# Altium schematic sheet SparkIO Thermal Shield.SchDoc: SparkIO Thermal Shield - Aux ADC
size A4; DrawnBy: Jim Griszbacher; Revision: A; SheetNumber: 1; SheetTotal: 1; ProjectName: SparkIO Thermal Shield
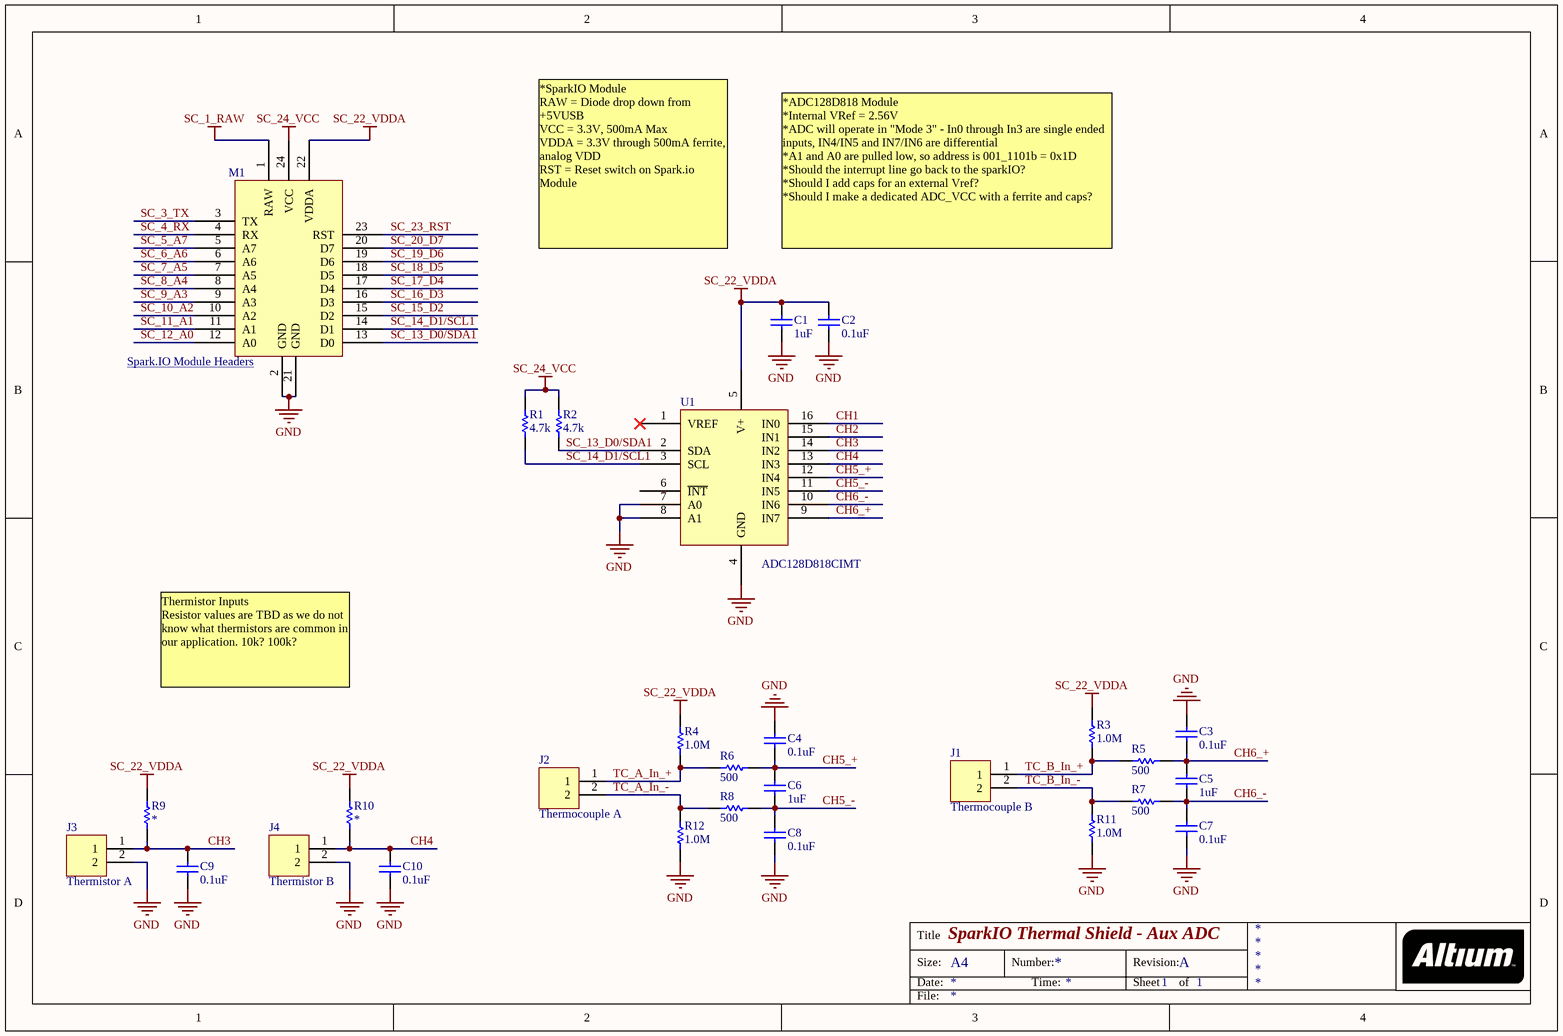
[diagram p0: SparkIO Thermal Shield.SchDoc]

## Parts
C1  value 1uF  [0603]  (hidden comment: Capacitor)
C2  value 0.1uF  [0603]  (hidden comment: Capacitor)
C3  value 0.1uF  [0603]  (hidden comment: Capacitor)
C4  value 0.1uF  [0603]  (hidden comment: Capacitor)
C5  value 1uF  [0603]  (hidden comment: Capacitor)
C6  value 1uF  [0603]  (hidden comment: Capacitor)
C7  value 0.1uF  [0603]  (hidden comment: Capacitor)
C8  value 0.1uF  [0603]  (hidden comment: Capacitor)
C9  value 0.1uF  [0603]  (hidden comment: Capacitor)
C10  value 0.1uF  [0603]  (hidden comment: Capacitor)
J1  Thermocouple B  [HDR1X2]
J2  Thermocouple A  [HDR1X2]
J3  Thermistor A  [HDR1X2]
J4  Thermistor B  [HDR1X2]
M1  Spark.IO Module Headers
R1  value 4.7k  [0603]  (hidden comment: Resistor)
R2  value 4.7k  [0603]  (hidden comment: Resistor)
R3  value 1.0M  [0603]  (hidden comment: Resistor)
R4  value 1.0M  [0603]  (hidden comment: Resistor)
R5  value 500  [0603]  (hidden comment: Resistor)
R6  value 500  [0603]  (hidden comment: Resistor)
R7  value 500  [0603]  (hidden comment: Resistor)
R8  value 500  [0603]  (hidden comment: Resistor)
R9  Resistor  [0603]  (value not drawn)
R10  Resistor  [0603]  (value not drawn)
R11  value 1.0M  [0603]  (hidden comment: Resistor)
R12  value 1.0M  [0603]  (hidden comment: Resistor)
U1  ADC128D818CIMT  [TSSOP16]

## Nets
GND: C1.2 C2.2 C3.1 C4.1 C7.2 C8.2 C9.2 C10.2 J3.2 J4.2 M1.2(GND) M1.21(GND) R11.2 R12.2 U1.4(GND) U1.7(A0) U1.8(A1)
SC_1_RAW: M1.1(RAW)
SC_22_VDDA: C1.1 C2.1 M1.22(VDDA) R3.1 R4.1 R9.1 R10.1 U1.5(V+)
SC_24_VCC: M1.24(VCC) R1.1 R2.1
CH1: U1.16(IN0)
CH2: U1.15(IN1)
CH3: C9.1 J3.1 R9.2 U1.14(IN2)
CH4: C10.1 J4.1 R10.2 U1.13(IN3)
CH5_+: C4.2 C6.1 R6.1 U1.12(IN4)
CH5_-: C6.2 C8.1 R8.1 U1.11(IN5)
CH6_+: C3.2 C5.1 R5.1 U1.9(IN7)
CH6_-: C5.2 C7.1 R7.1 U1.10(IN6)
SC_3_TX: M1.3(TX)
SC_4_RX: M1.4(RX)
SC_5_A7: M1.5(A7)
SC_6_A6: M1.6(A6)
SC_7_A5: M1.7(A5)
SC_8_A4: M1.8(A4)
SC_9_A3: M1.9(A3)
SC_10_A2: M1.10(A2)
SC_11_A1: M1.11(A1)
SC_12_A0: M1.12(A0)
SC_13_D0/SDA1: M1.13(D0) R2.2 U1.2(SDA)
SC_14_D1/SCL1: M1.14(D1) R1.2 U1.3(SCL)
SC_15_D2: M1.15(D2)
SC_16_D3: M1.16(D3)
SC_17_D4: M1.17(D4)
SC_18_D5: M1.18(D5)
SC_19_D6: M1.19(D6)
SC_20_D7: M1.20(D7)
SC_23_RST: M1.23(RST)
TC_A_In_+: J2.1 R4.2 R6.2
TC_A_In_-: J2.2 R8.2 R12.1
TC_B_In_+: J1.1 R3.2 R5.2
TC_B_In_-: J1.2 R7.2 R11.1

Not connected (* = marked no-connect by the designer): U1 1(VREF)* 6(~{INT})

## Notes on the sheet
- *SparkIO Module
  RAW = Diode drop down from +5VUSB
  VCC = 3.3V, 500mA Max
  VDDA = 3.3V through 500mA ferrite, analog VDD
  RST = Reset switch on Spark.io Module
- *ADC128D818 Module
  *Internal VRef = 2.56V
  *ADC will operate in "Mode 3" - In0 through In3 are single ended inputs, IN4/IN5 and IN7/IN6 are differential
  *A1 and A0 are pulled low, so address is 001_1101b = 0x1D
  *Should the interrupt line go back to the sparkIO?
  *Should I add caps for an external Vref?
  *Should I make a dedicated ADC_VCC with a ferrite and caps?
- Thermistor Inputs
  Resistor values are TBD as we do not know what thermistors are common in our application. 10k? 100k?
- Title
- Size:
- Date:
- A4
- Number:
- Time:
- Revision:
- Sheet
- of
- File:

## Library data of the parts
J1-J4 = Header 2: Header .1" 2 Pos
M1 = SparkIO Module Interface: SparkIO Module Interface Headers
U1 = ADC128D818CIMT: TI ADC128D818CIMT 12bit ADC
R1-R12 = Resistor
  R9 R10: Value: *